# Altium schematic sheet Sheet10.SchDoc
size A4
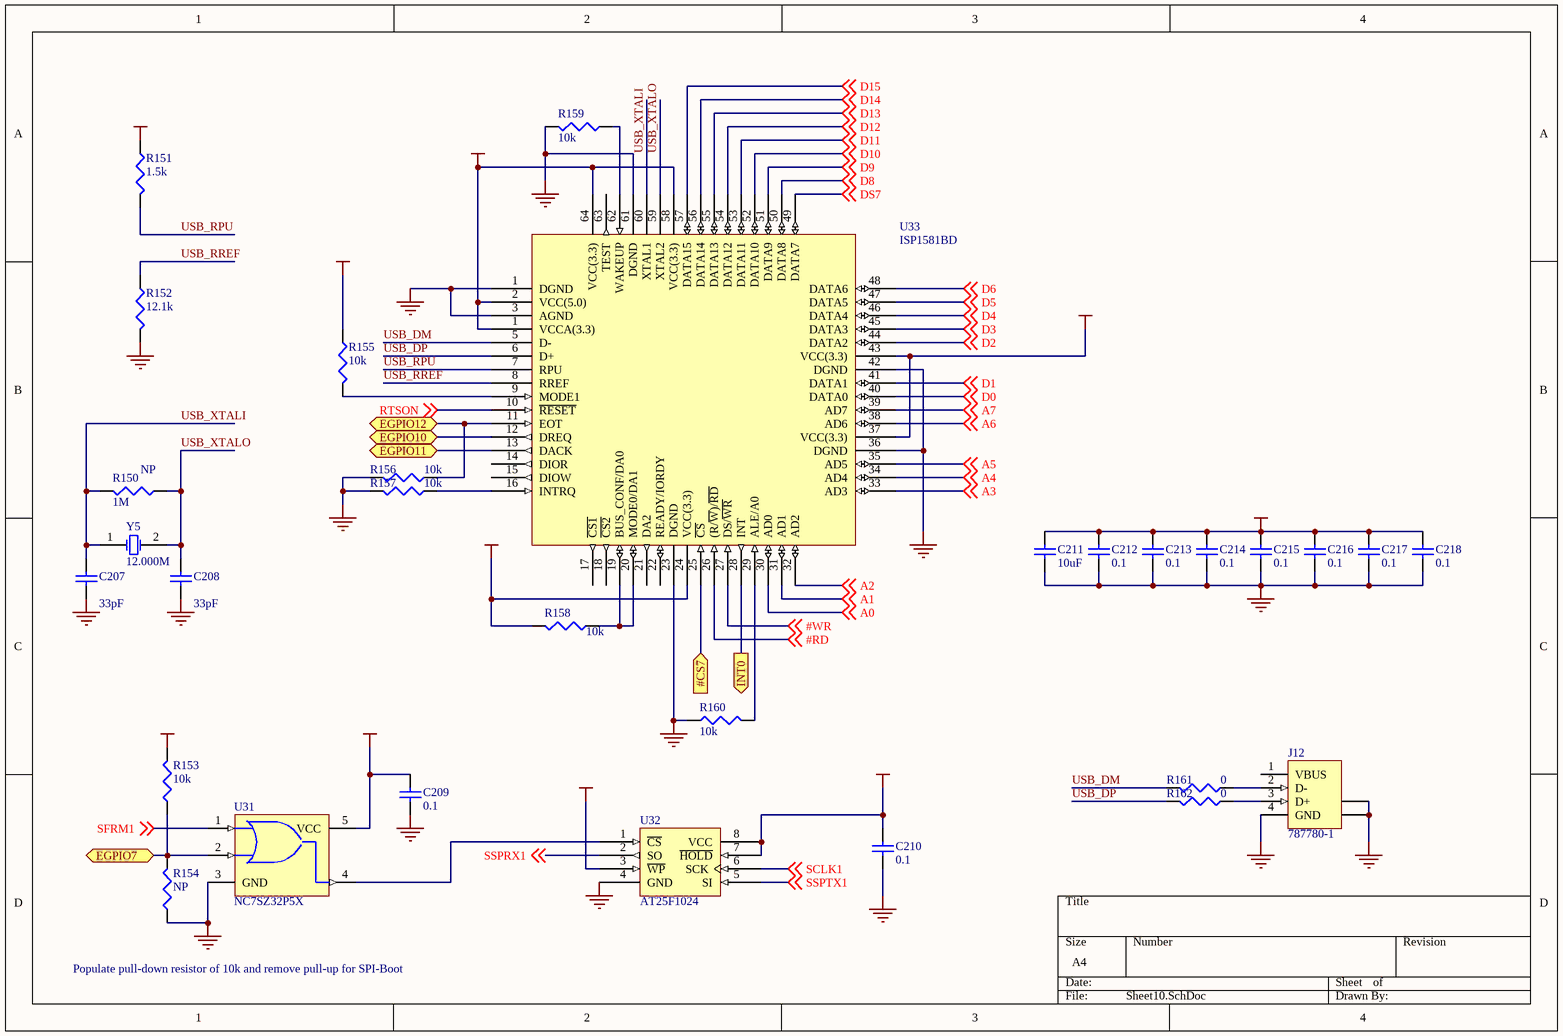
[diagram p0: Sheet10.SchDoc]

## Parts
C207  33pF  [0603]
C208  33pF  [0603]
C209  0.1  [0603]
C210  0.1  [0603]
C211  10uF  [1206]
C212  0.1  [0603]
C213  0.1  [0603]
C214  0.1  [0603]
C215  0.1  [0603]
C216  0.1  [0603]
C217  0.1  [0603]
C218  0.1  [0603]
J12  787780-1  [787780]
R150  NP  value 1M  [CR1608-0603]
R151  1.5k  [CR1608-0603]
R152  12.1k  [CR1608-0603]
R153  10k  [CR1608-0603]
R154  NP  [CR1608-0603]
R155  10k  [CR1608-0603]
R156  10k  [CR1608-0603]
R157  10k  [CR1608-0603]
R158  10k  [CR1608-0603]
R159  10k  [CR1608-0603]
R160  10k  [CR1608-0603]
R161  0  [CR1608-0603]
R162  0  [CR1608-0603]
U31  NC7SZ32P5X  [SC88A]
U32  AT25F1024  [M08A]
U33  ISP1581BD  [LQFP64]
Y5  12.000M  [CSM-7]

## Ports
#CS7 (in), EGPIO7 (bidir), EGPIO10 (bidir), EGPIO11 (bidir), EGPIO12 (bidir), INT0 (out)

## Nets
GND: C207.1 C208.1 C209.2 C210.2 C211.1 C212.2 C213.2 C214.2 C215.2 C216.2 C217.2 C218.2 J12.4(GND) J12.5(SHLD) J12.6(SHLD) R152.2 R154.1 R156.2 R157.2 R159.2 R160.1 U31.3(GND) U32.4(GND) U33.1(DGND) U33.3(AGND) U33.23(DGND) U33.36(DGND) U33.42(DGND) U33.61(DGND)
VCCIO: C209.1 C210.1 C211.2 C212.1 C213.1 C214.1 C215.1 C216.1 C217.1 C218.1 R151.1 R153.2 R155.1 R158.2 U31.5(VCC) U32.3(~{WP}) U32.7(~{HOLD}) U32.8(VCC) U33.1(VCCA(3.3)) U33.2(VCC(5.0)) U33.24(VCC(3.3)) U33.37(VCC(3.3)) U33.43(VCC(3.3)) U33.58(VCC(3.3)) U33.64(VCC(3.3))
#CS7: U33.25(~{CS}) ; port #CS7
#RD: U33.26((R/~{W})/~{RD}) ; off-sheet #RD
#WR: U33.27(DS/~{WR}) ; off-sheet #WR
A0: U33.30(AD0) ; off-sheet A0
A1: U33.31(AD1) ; off-sheet A1
A2: U33.32(AD2) ; off-sheet A2
A3: U33.33(AD3) ; off-sheet A3
A4: U33.34(AD4) ; off-sheet A4
A5: U33.35(AD5) ; off-sheet A5
A6: U33.38(AD6) ; off-sheet A6
A7: U33.39(AD7) ; off-sheet A7
D0: U33.40(DATA0) ; off-sheet D0
D1: U33.41(DATA1) ; off-sheet D1
D2: U33.44(DATA2) ; off-sheet D2
D3: U33.45(DATA3) ; off-sheet D3
D4: U33.46(DATA4) ; off-sheet D4
D5: U33.47(DATA5) ; off-sheet D5
D6: U33.48(DATA6) ; off-sheet D6
D8: U33.50(DATA8) ; off-sheet D8
D9: U33.51(DATA9) ; off-sheet D9
D10: U33.52(DATA10) ; off-sheet D10
D11: U33.53(DATA11) ; off-sheet D11
D12: U33.54(DATA12) ; off-sheet D12
D13: U33.55(DATA13) ; off-sheet D13
D14: U33.56(DATA14) ; off-sheet D14
D15: U33.57(DATA15) ; off-sheet D15
DS7: U33.49(DATA7) ; off-sheet DS7
EGPIO7: R153.1 R154.2 U31.2(B) ; port EGPIO7
EGPIO10: U33.12(DREQ) ; port EGPIO10
EGPIO11: U33.13(DACK) ; port EGPIO11
EGPIO12: R156.1 U33.11(EOT) ; port EGPIO12
INT0: U33.28(INT) ; port INT0
RTSON: U33.10(~{RESET}) ; off-sheet RTSON
SCLK1: U32.6(SCK) ; off-sheet SCLK1
SFRM1: U31.1(A) ; off-sheet SFRM1
SSPRX1: U32.2(SO) ; off-sheet SSPRX1
SSPTX1: U32.5(SI) ; off-sheet SSPTX1
USB_DM: R161.2 U33.5(D-)
USB_DP: R162.2 U33.6(D+)
USB_RPU: R151.2 U33.7(RPU)
USB_RREF: R152.1 U33.8(RREF)
USB_XTALI: C207.2 R150.2 U33.60(XTAL1) Y5.1(OSC1)
USB_XTALO: C208.2 R150.1 U33.59(XTAL2) Y5.2(OSC2)
NetJ12_2: J12.2(D-) R161.1
NetJ12_3: J12.3(D+) R162.1
NetR155_2: R155.2 U33.9(MODE1)
NetR157_1: R157.1 U33.16(INTRQ)
NetR158_1: R158.1 U33.19(BUS_CONF/DA0) U33.20(MODE0/DA1)
NetR159_1: R159.1 U33.62(WAKEUP)
NetR160_2: R160.2 U33.29(ALE/A0)
NetU31_4: U31.4(Y) U32.1(~{CS})

Not connected (* = marked no-connect by the designer): J12 1(VBUS); U33 14(DIOR) 15(DIOW) 17(~{CS1}) 18(~{CS2}) 21(DA2) 22(READY/IORDY) 63(TEST)

## Notes on the sheet
- Populate pull-down resistor of 10k and remove pull-up for SPI-Boot

## Library data of the parts
C207-C210 C212-C218 = C0603: Ceramic Chip Capacitor - Standard; Note: Footprint corresponds to dimensions for bulk cassette packaging. This case size has tightened tolerances.; Published: 17-Jul-2002; LatestRevisionDate: 19-Mar-2004; LatestRevisionNote: Silkscreen size reduced.; DatasheetDocument: Mar-2001; PackageDocument: Mar-2001; PackageReference: 0603; Publisher: Altium Limited; Code_JEITA: 0603; Code_IPC: 1608 [0603]; ComponentLink1Description: Manufacturer Link; ComponentLink1URL: http://www.kemet.com/; ComponentLink2Description: Datasheet; ComponentLink2URL: http://www.kemet.com/kemet/web/homepage/kechome.nsf/vapubfilesname/F3102TA.pdf/$file/F3102TA.pdf
  C207 C208: Value: 33pF
  C209 C210 C212-C218: Value: 0.1
C211 = C1206: Ceramic Chip Capacitor - Standard; Published: 17-Jul-2002; LatestRevisionDate: 19-Mar-2004; LatestRevisionNote: Silkscreen size reduced.; DatasheetDocument: Mar-2001; PackageDocument: Mar-2001; PackageReference: 1206; Publisher: Altium Limited; Code_JEITA: 1206; Code_IPC: 3216 [1206]; ComponentLink1Description: Manufacturer Link; ComponentLink1URL: http://www.kemet.com/; ComponentLink2Description: Datasheet; ComponentLink2URL: http://www.kemet.com/kemet/web/homepage/kechome.nsf/vapubfilesname/F3102TA.pdf/$file/F3102TA.pdf; Value: 10uF
J12 = 787780-1: USB 1.1, Right Angle, Thru-Hole, B Type, Receptacle, 4 Position, Black; ContactMaterial: Copper Alloy; ContactPlating: Gold Flash over Palladium Nickel or Gold (30) over Nickel; TerminationLength: 3.00mm [0.118in.]; PCB_Layout: Complies with manufacturer's recommendation.; DrillSize: Corresponds to nominal value.; PanelGround: Without; Published: 15-Jul-2004; DatasheetDocument: 11-Jan-2004; PackageDocument: 11-Jan-2004; PackageReference: 787780; Publisher: Altium Limited; ComponentLink1Description: Manufacturer Link; ComponentLink1URL: http://www.tycoelectronics.com/; HousingMaterial: Thermoplastic
R150-R162 = Res3: Resistor; Published: 8-Jun-2000; Revision: July-2002: Re-released for DXP Platform.; Publisher: Altium Limited
  R151: Value: 1.5k
  R152: Value: 12.1k
  R153 R155-R160: Value: 10k
  R154: Value: NP
  R161 R162: Value: 0
U31 = NC7SZ32P5X: TinyLogic UHS 2-Input OR Gate
U32 = AT25F1024: 1Mbit High Speed SPI Serial Flash Memory
U33 = ISP1581BD: Hi-Speed Universal Serial Bus peripheral controller
Y5 = ECS-110-S-5P: Crystal Oscillator; Published: 17-Jul-2002; Datasheet: Latest Revision: 18-Apr-2000; Package Reference: CSM-7; Publisher: Altium Limited